# Altium schematic sheet PlusBit_Sensors.SchDoc
size A4; SheetNumber: 5; SheetTotal: 5
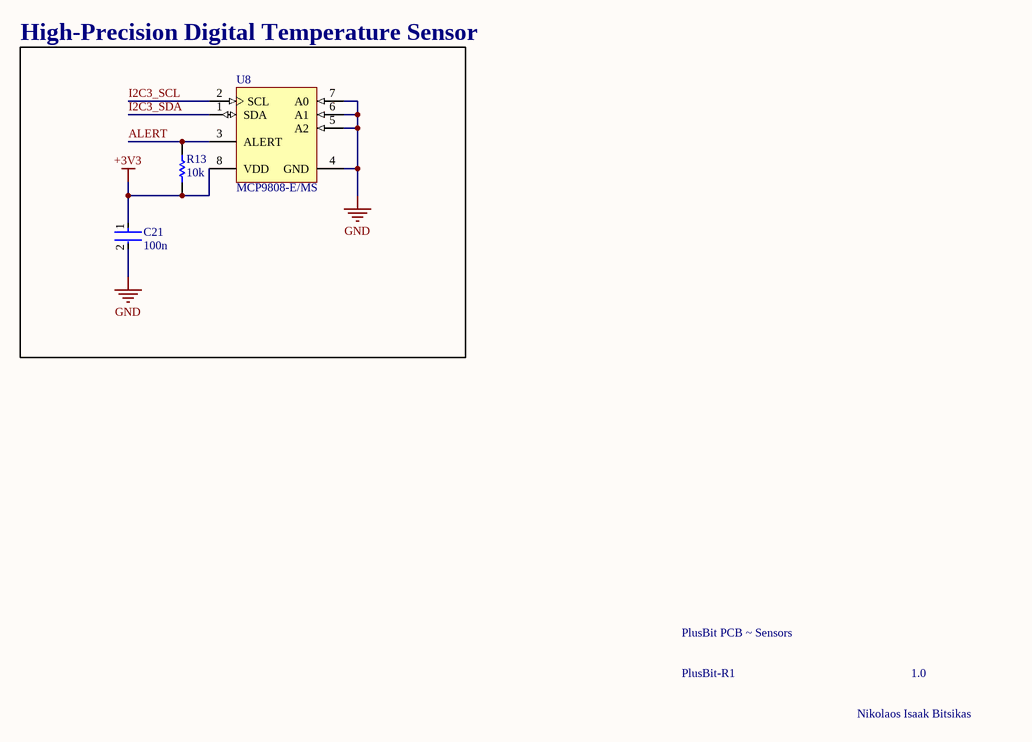
[diagram p0: PlusBit_Sensors.SchDoc]

## Parts
C21  100n  [FP-C0402-BB-MFG]
R13  10k  [RESC1608X55X25ML10T15]
U8  MCP9808-E/MS  [MCHP-MSOP-MS8_L]

## Blocks framed on the sheet
High-Precision Digital Temperature Sensor: C21 R13 U8

## Nets
+3V3: C21.1 R13.1 U8.8(VDD)
GND: C21.2 U8.4(GND) U8.5(A2) U8.6(A1) U8.7(A0)
ALERT: R13.2 U8.3(ALERT)
I2C3_SCL: U8.2(SCL)
I2C3_SDA: U8.1(SDA)

## Notes on the sheet
- PlusBit PCB ~ Sensors
- PlusBit-R1
- 1.0
- Nikolaos Isaak Bitsikas

## Library data of the parts
C21 = CMP-2008-02046-2: CAP CER 0.1UF 10V X5R 0402; Manufacturer: Kemet; Manufacturer Part Number: C0402C104K8PACTU; Material: Ceramic; Capacitance: 0.10 μF; Temperature Coefficient: 15%; Tolerance: 0.1; Value: 0.10 μF; Package: C0402-BB; Temperature: -55°C to +125°C; ComponentLink2Description: Datasheet; Temperature Characteristic: X5R; Device Class L1: Passive Components; Height: 0.55mm; Lead Free: Yes; ComponentLink2URL: https://content.kemet.com/datasheets/KEM_C1002_X7R_SMD.pdf; Device Class L2: Capacitors; Temperature Range Low: -55°C; Temperature Range High: +125°C; RoHS: TRUE; Octopart: https://octopart.com/c0402c104k8pactu-kemet-140039; Automotive: No; Mouser Description: Capacitor 100 nF 10 VDC 0402; Category: Cap; Voltage Rating: 10 V; Digikey Description: CAP CER 0.1UF 10V X5R 0402; Ipc Land Pattern Name: CAPC10050X50; Device Class L3: Ceramic Capacitors
R13 = CMP-2000-05022-1: Resistor, 10 KOhm, +/- 5%, 100 mW, -55 to 155 degC, 0603 (1608 Metric), RoHS, Tape and Reel; Manufacturer: Yageo; Resistance: 10kOhms; Voltage Rating: 50V; Temperature Coefficient: 100PPM/C; Power Rating: 100mW; Package Reference: 603; Series: RC; Case Code - mm: 1608; Packaging: Reel; Datasheet URL: http://www.farnell.com/datasheets/443971.pdf; Datasheet Version: Rev. 4, 04/2009; Operating Temperature Range: -55Cto+155C; Product: ThickFilmResistorsGeneralPurpose; Package Description: 2-Pin Surface Mount Device, Body 1.6 x 0.8 mm; Manufacturer URL: http://www.yageo.com/; Case Code - in: 0603; Tolerance: 5%; Termination Style: SMD/SMT
U8 = CMP-0192-00344-1: + / - 0.5 degC Maximum Accuracy Digital Temperature Sensor, 400 uA, 2.7 to 5.5 V, -40 to 125 degC, 8-pin MSOP (MS8), Tube; Manufacturer: Microchip; ComponentLink3Description: Package Specification; ComponentLink4URL: http://www.microchip.com/MCP9808; PackageDescription: 8-Lead Plastic Micro Small Outline Package, 3 x 3 mm Body, 0.65 mm Pitch; ComponentLink2Description: Datasheet; PartNumber: MCP9808-E/MS; Mounting Technology: Surface Mount; ComponentLink4Description: Product URL; ComponentLink1Description: Manufacturer URL; ComponentLink2URL: http://ww1.microchip.com/downloads/en/DeviceDoc/25095A.pdf; ComponentLink3URL: http://www.microchip.com/stellent/groups/techpub_sg/documents/packagingspec/en012702.pdf; DatasheetVersion: Rev. A; ComponentLink1URL: http://www.microchip.com; PackageReference: MSOP-MS8; PackageVersion: C04-111C